# EAGLE design Replacement Board (EAGLE 5.09)
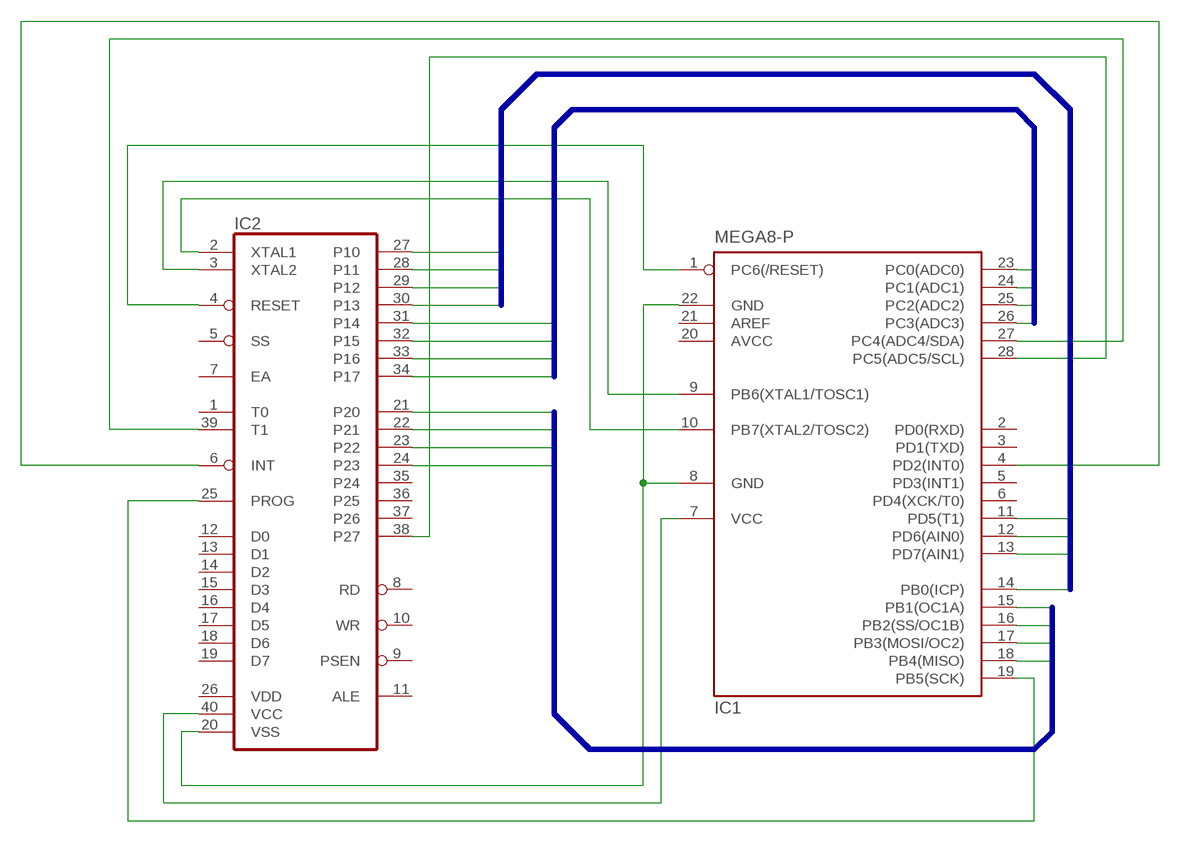
[diagram p0: schematic, sheet 1]

## Parts
IC1  MEGA8-P  [DIL28-3]
IC2  8749  [DIL40]

## Nets
B$1: IC1.15(PB1(OC1A)) IC1.16(PB2(SS/OC1B)) IC1.17(PB3(MOSI/OC2)) IC1.18(PB4(MISO)) IC2.21(P20) IC2.22(P21) IC2.23(P22) IC2.24(P23)
B$2: IC1.23(PC0(ADC0)) IC1.24(PC1(ADC1)) IC1.25(PC2(ADC2)) IC1.26(PC3(ADC3)) IC2.31(P14) IC2.32(P15) IC2.33(P16) IC2.34(P17)
B$3: IC1.11(PD5(T1)) IC1.12(PD6(AIN0)) IC1.13(PD7(AIN1)) IC1.14(PB0(ICP)) IC2.27(P10) IC2.28(P11) IC2.29(P12) IC2.30(P13)
N$1: IC1.28(PC5(ADC5/SCL)) IC2.38(P27)
N$2: IC1.9(PB6(XTAL1/TOSC1)) IC2.3(XTAL2)
N$3: IC1.1(PC6(/RESET)) IC2.4(RESET)
N$4: IC1.8(GND) IC1.22(GND) IC2.20(VSS)
N$5: IC1.7(VCC) IC2.40(VCC)
N$6: IC1.4(PD2(INT0)) IC2.6(INT)
N$7: IC1.10(PB7(XTAL2/TOSC2)) IC2.2(XTAL1)
N$8: IC1.27(PC4(ADC4/SDA)) IC2.39(T1)
N$15: IC1.19(PB5(SCK)) IC2.25(PROG)
Unconnected: IC1.2(PD0(RXD)) IC1.3(PD1(TXD)) IC1.5(PD3(INT1)) IC1.6(PD4(XCK/T0)) IC1.21(AREF) IC2.1(T0) IC2.5(SS) IC2.7(EA) IC2.8(RD) IC2.9(PSEN) IC2.10(WR) IC2.11(ALE) IC2.12(D0) IC2.13(D1) IC2.14(D2) IC2.15(D3) IC2.16(D4) IC2.17(D5) IC2.18(D6) IC2.19(D7) IC2.35(P24) IC2.36(P25) IC2.37(P26)

## Buses
B$1
B$2
B$3

## Power pins joined to a net without a drawn wire
AVCC: IC1.20(AVCC)
VDD: IC2.26(VDD)

## Library data of the parts
IC1 = atmel:MEGA8-P: MICROCONTROLLER 8 Kbytes FLASH, 1 kbytes SRAM, 512 bytes EEPROM, USART, 4-channel 10 bit ADC, 2-channel 8 bit ADC Pin compatible with Atmega48, ATMega88, ATMega168 Source: avr.lbr
IC2 = micro-intel:8749: MICROCOMPUTER/PERIPHERAL DEVICE

## Board
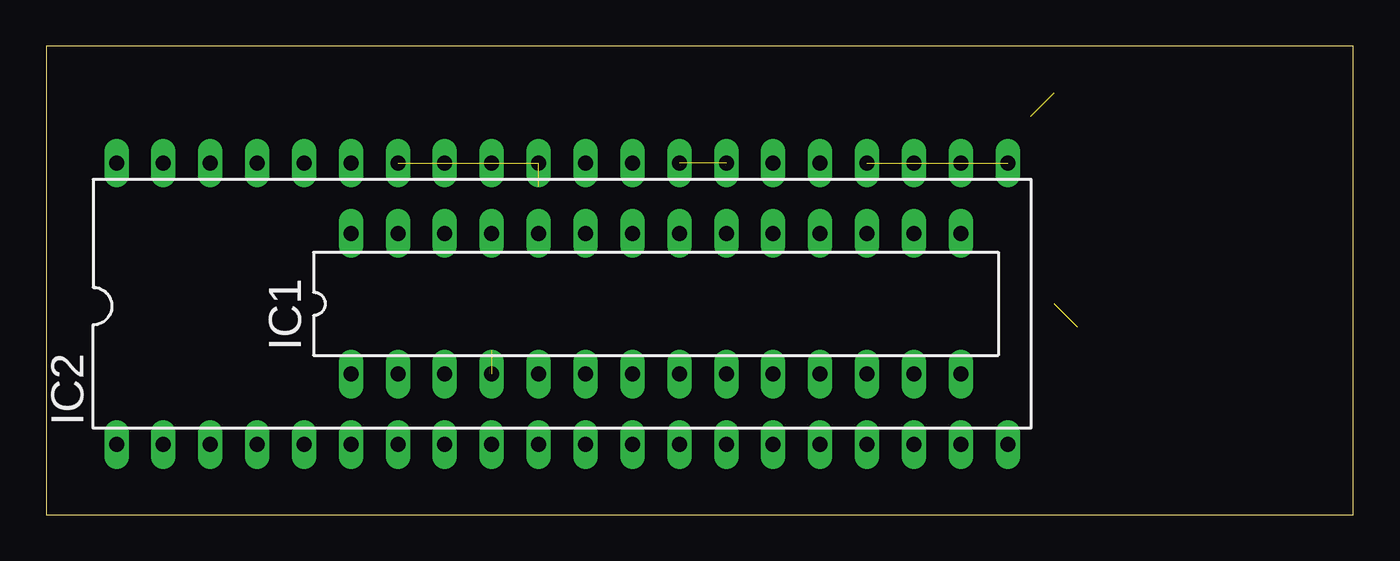
[diagram p1: board, top side]
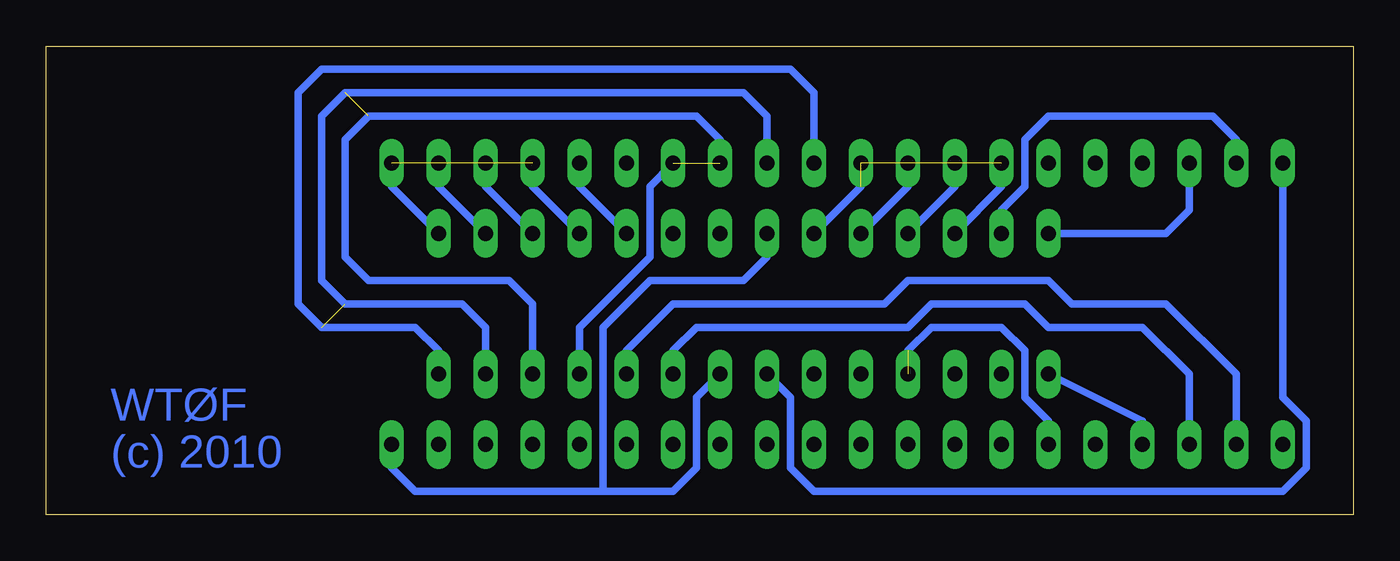
[diagram p2: board, bottom side, seen from below]

Size 70.79 x 25.39 mm. Coordinates in mm from the lower left corner, seen from the top.
Outline: 0,0 70.79,0 70.79,25.39 0,25.39 0,0
Copper layers (1*16): Top 0.035mm / dielectric 1.5mm / Bottom 0.035mm
Design rules "default": minimum track width 10mil, minimum drill 24mil, track to track 8mil, track to pad 8mil, pad to pad 8mil, via to via 8mil, smd to smd 8mil, copper to edge 40mil, drill to drill 8mil, minimum pad ring 10mil, minimum via ring 8mil, stop-mask expansion 4mil, vias tented up to drill 0mil, thermal gap 10mil

### Footprints (pad centres in the part's own frame; a part is rotated, then mirrored left to right if it is on the bottom)
DIL28-3 = drill 0.813 long: 1 -16.51,-3.81; 2 -13.97,-3.81; 3 -11.43,-3.81; 4 -8.89,-3.81; 5 -6.35,-3.81; 6 -3.81,-3.81; 7 -1.27,-3.81; 8 1.27,-3.81; 9 3.81,-3.81; 10 6.35,-3.81; 11 8.89,-3.81; 12 11.43,-3.81; 13 13.97,-3.81; 14 16.51,-3.81; 15 16.51,3.81; 16 13.97,3.81; 17 11.43,3.81; 18 8.89,3.81; 19 6.35,3.81; 20 3.81,3.81; 21 1.27,3.81; 22 -1.27,3.81; 23 -3.81,3.81; 24 -6.35,3.81; 25 -8.89,3.81; 26 -11.43,3.81; 27 -13.97,3.81; 28 -16.51,3.81
DIL40 = drill 0.813 long: 1 -24.13,-7.62; 2 -21.59,-7.62; 3 -19.05,-7.62; 4 -16.51,-7.62; 5 -13.97,-7.62; 6 -11.43,-7.62; 7 -8.89,-7.62; 8 -6.35,-7.62; 9 -3.81,-7.62; 10 -1.27,-7.62; 11 1.27,-7.62; 12 3.81,-7.62; 13 6.35,-7.62; 14 8.89,-7.62; 15 11.43,-7.62; 16 13.97,-7.62; 17 16.51,-7.62; 18 19.05,-7.62; 19 21.59,-7.62; 20 24.13,-7.62; 21 24.13,7.62; 22 21.59,7.62; 23 19.05,7.62; 24 16.51,7.62; 25 13.97,7.62; 26 11.43,7.62; 27 8.89,7.62; 28 6.35,7.62; 29 3.81,7.62; 30 1.27,7.62; 31 -1.27,7.62; 32 -3.81,7.62; 33 -6.35,7.62; 34 -8.89,7.62; 35 -11.43,7.62; 36 -13.97,7.62; 37 -16.51,7.62; 38 -19.05,7.62; 39 -21.59,7.62; 40 -24.13,7.62

### Placement (x,y rotation side)
IC1  33.02,11.43 0 top
IC2  27.94,11.43 0 top

### Tracks (layer width: path | path; a pad name or v marks a point on that pad's centre or on a via)
B$1  (3 unrouted)
  Bottom 0.406: IC1.15 52.07,17.78 IC2.21 | IC1.16 49.53,17.78 IC2.22 | IC1.17 46.99,17.78 IC2.23 | IC1.18 44.45,17.78 IC2.24
B$2  (4 unrouted)
  Bottom 0.406: IC1.23 26.67,17.78 | IC1.24 24.13,17.78 IC2.32 | IC1.25 21.59,17.78 IC2.33 | IC1.26 19.05,17.78 IC2.34
B$3  (3 unrouted)
  Bottom 0.406: IC2.27 38.1,17.78 38.1,13.97 41.91,10.16 IC1.11 | IC1.12 44.45,11.43 45.72,12.7 53.34,12.7 54.61,13.97 54.61,20.32 53.34,21.59 35.56,21.59 34.29,20.32 IC2.28 | IC1.13 46.99,10.16 48.26,11.43 54.61,11.43 55.88,12.7 55.88,21.59 54.61,22.86 33.02,22.86 31.75,21.59 IC2.29 | IC1.14 49.53,8.89 50.8,10.16 55.88,10.16 57.15,11.43 57.15,22.86 55.88,24.13 30.48,24.13 29.21,22.86 IC2.30
N$1
  Bottom 0.406: IC1.28 10.16,15.24 8.89,16.51 IC2.38
N$2
  Bottom 0.406: IC2.3 8.89,7.62 11.43,10.16 16.51,10.16 17.78,11.43 22.86,11.43 24.13,10.16 35.56,10.16 36.83,8.89 IC1.9
N$3
  Bottom 0.406: IC1.1 11.43,5.08 IC2.4
N$4
  Bottom 0.406: IC2.20 52.07,2.54 50.8,1.27 40.64,1.27 | 40.64,1.27 40.64,10.16 38.1,12.7 33.02,12.7 31.75,13.97 IC1.22 | IC1.8 35.56,6.35 35.56,2.54 36.83,1.27 40.64,1.27
N$5
  Bottom 0.406: IC2.40 3.81,6.35 2.54,5.08 2.54,2.54 3.81,1.27 29.21,1.27 30.48,2.54 30.48,6.35 IC1.7
N$6  (1 unrouted)
  Bottom 0.406: IC2.6 16.51,5.08 17.78,6.35 17.78,8.89 19.05,10.16 22.86,10.16 24.13,8.89
N$7
  Bottom 0.406: IC1.10 39.37,8.89 36.83,11.43 25.4,11.43 24.13,12.7 16.51,12.7 15.24,11.43 10.16,11.43 6.35,7.62 IC2.2
N$8
  Bottom 0.406: IC1.27 19.05,16.51 17.78,17.78 17.78,20.32 16.51,21.59 7.62,21.59 6.35,20.32 IC2.39
N$15
  Bottom 0.406: IC1.19 41.91,17.78 IC2.25

### Text on the board
Bottom: WTØF | (c) 2010